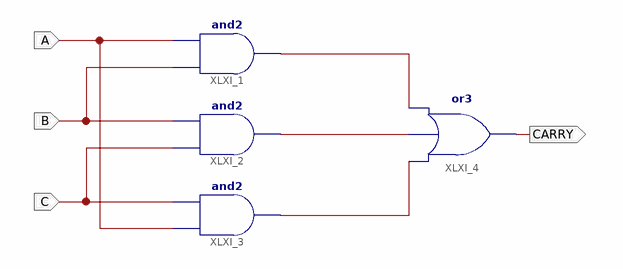
[diagram p0: schematic sheet 1]
// Xilinx ISE schematic PWM_V2.sch (spartan3e) as structural Verilog: 4 symbols, 4 ports
module PWM_V2 (
  input  A,
  input  B,
  input  C,
  output CARRY
);

  wire XLXN_1, XLXN_2, XLXN_3;

  and XLXI_1 (XLXN_1, B, A);
  and XLXI_2 (XLXN_2, C, B);
  and XLXI_3 (XLXN_3, A, C);
  or XLXI_4 (CARRY, XLXN_3, XLXN_2, XLXN_1);
endmodule
